# EAGLE design internet_enabled_rov (EAGLE 6.1)
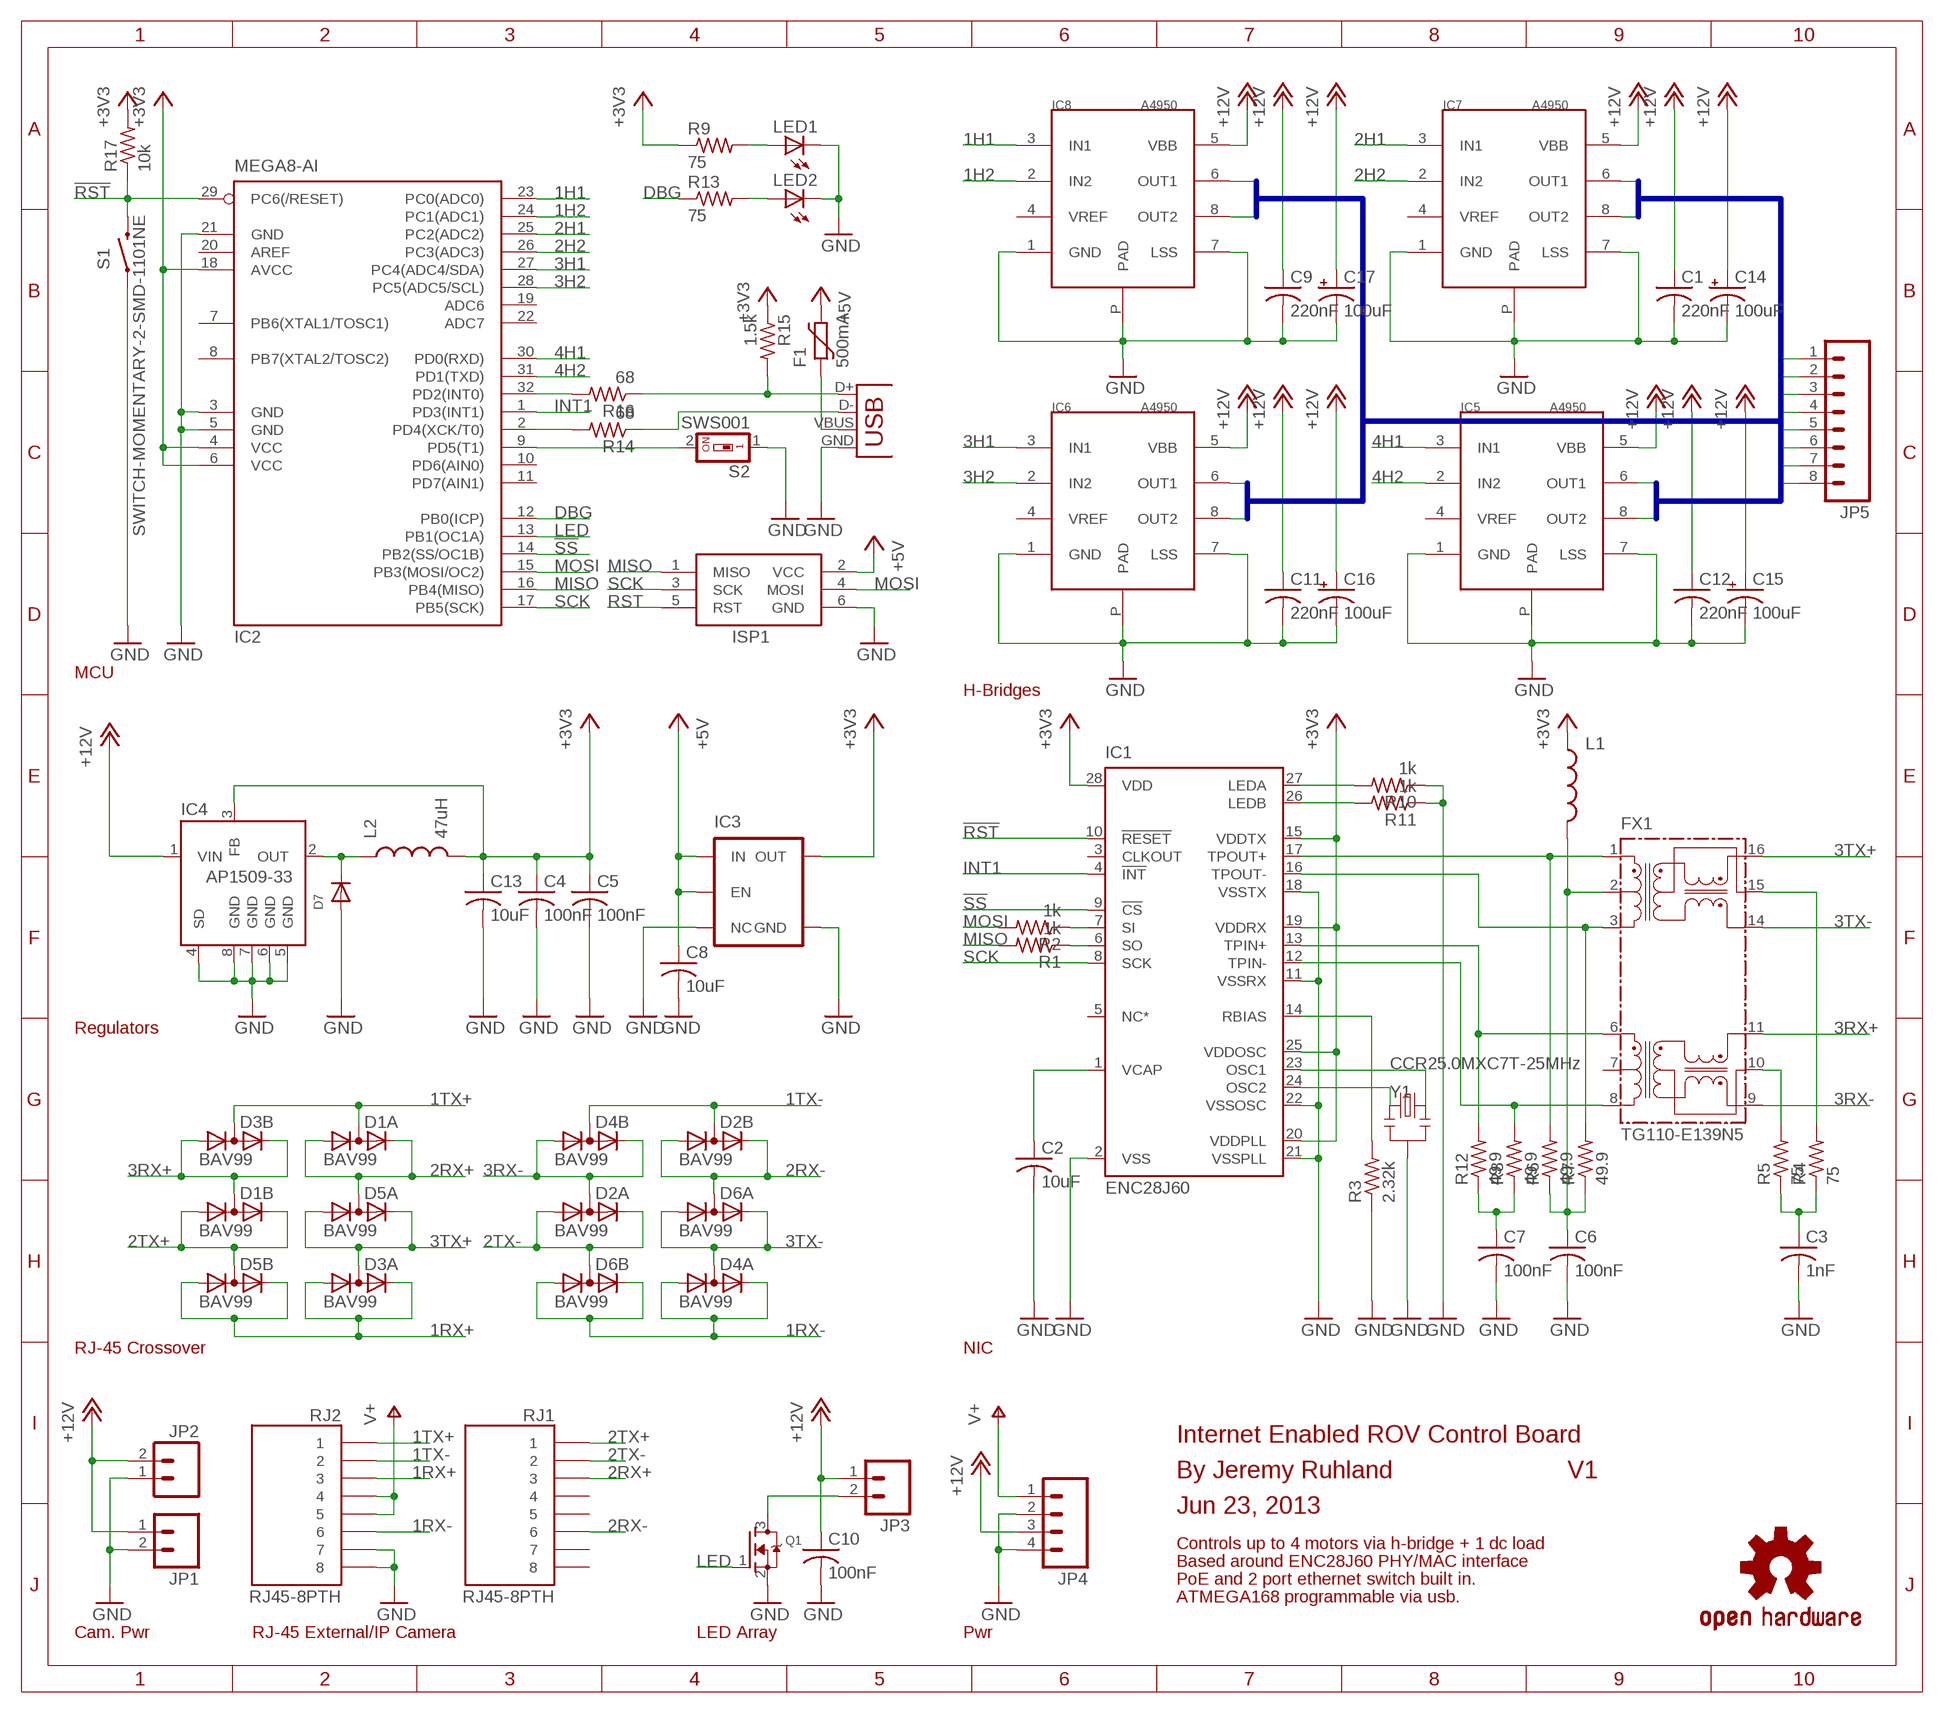
[diagram p0: schematic, sheet 1]

## Parts
C1  220nF  C-USC1206  [C1206]
C2  10uF  C-USC1206  [C1206]
C3  1nF  C-USC1206  [C1206]
C4  100nF  C-USC1206  [C1206]
C5  100nF  C-USC1206  [C1206]
C6  100nF  C-USC1206  [C1206]
C7  100nF  C-USC1206  [C1206]
C8  10uF  C-USC1206  [C1206]
C9  220nF  C-USC1206  [C1206]
C10  100nF  C-USC1206  [C1206]
C11  220nF  C-USC1206  [C1206]
C12  220nF  C-USC1206  [C1206]
C13  10uF  C-USC1206  [C1206]
C14  100uF  CAP_POLD  [PANASONIC_D]
C15  100uF  CAP_POLD  [PANASONIC_D]
C16  100uF  CAP_POLD  [PANASONIC_D]
C17  100uF  CAP_POLD  [PANASONIC_D]
D1  BAV99  [SOT363]
D2  BAV99  [SOT363]
D3  BAV99  [SOT363]
D4  BAV99  [SOT363]
D5  BAV99  [SOT363]
D6  BAV99  [SOT363]
D7  DIODESOD-123  [SOD-123]
F1  500mA  FUSE_PTC-0805  [PTC0805]
FX1  TG110-E139N5  [N5]
IC1  ENC28J60  [SO28W]
IC2  MEGA8-AI  [TQFP32-08]
IC3  V_REG_TPS76433SOT23-5  [SOT23-5]
IC4  AP1509-33  AP1509  [SOP-8]
IC5  A4950  [SOIC-8-PAD]
IC6  A4950  [SOIC-8-PAD]
IC7  A4950  [SOIC-8-PAD]
IC8  A4950  [SOIC-8-PAD]
ISP1  AVRISP-6  [AVRISP]
JP1  M02LOCK  [1X02_LOCK]
JP2  M02LOCK  [1X02_LOCK]
JP3  M02LOCK  [1X02_LOCK]
JP4  M04SCREW_LOCK  [SCREWTERMINAL-3.5MM-4_LOCK]
JP5  M083.5MM-8  [SCREWTERMINAL-3.5MM-8]
L1  INDUCTOR1210  [1210]
L2  47uH  INDUCTOR1210  [1210]
LED1  LEDCHIPLED_1206  [CHIPLED_1206]
LED2  LEDCHIPLED_1206  [CHIPLED_1206]
Q1  MOSFET-NREFLOW  [SOT23]
R1  1k  R-US_R1206  [R1206]
R2  1k  R-US_R1206  [R1206]
R3  2.32k  R-US_R1206  [R1206]
R4  75  R-US_R1206  [R1206]
R5  75  R-US_R1206  [R1206]
R6  49.9  R-US_R1206  [R1206]
R7  49.9  R-US_R1206  [R1206]
R8  49.9  R-US_R1206  [R1206]
R9  75  R-US_R1206  [R1206]
R10  1k  R-US_R1206  [R1206]
R11  1k  R-US_R1206  [R1206]
R12  49.9  R-US_R1206  [R1206]
R13  75  R-US_R1206  [R1206]
R14  68  R-US_R1206  [R1206]
R15  1.5k  R-US_R1206  [R1206]
R16  68  R-US_R1206  [R1206]
R17  10k  R-US_R1206  [R1206]
RJ1  RJ45-8PTH  [RJ45-8]
RJ2  RJ45-8PTH  [RJ45-8]
S1  SWITCH-MOMENTARY-2-SMD-1101NE  [TACTILE-SWITCH-1101NE]
S2  SWS001  [SMS-001]
U$1  OSHW-LOGOL  [OSHW-LOGO-L]
X1  USBSMD  [USB-MINIB]
Y1  CCR25.0MXC7T-25MHz  RESONATORSMD  [RESONATOR-SMD]

## Nets
1H1: IC2.23(PC0(ADC0)) IC8.3(IN1)
1H2: IC2.24(PC1(ADC1)) IC8.2(IN2)
1RX+: D3.1(A:A) D3.2(A:K) D5.4(B:A) D5.5(B:K) RJ2.3
1RX-: D4.1(A:A) D4.2(A:K) D6.4(B:A) D6.5(B:K) RJ2.6
1TX+: D1.6(A:AK) D3.3(B:AK) RJ2.1
1TX-: D2.3(B:AK) D4.3(B:AK) RJ2.2
2H1: IC2.25(PC2(ADC2)) IC7.3(IN1)
2H2: IC2.26(PC3(ADC3)) IC7.2(IN2)
2RX+: D1.1(A:A) D1.2(A:K) D5.6(A:AK) RJ1.3
2RX-: D2.4(B:A) D2.5(B:K) D6.6(A:AK) RJ1.6
2TX+: D1.4(B:A) D1.5(B:K) D5.3(B:AK) RJ1.1
2TX-: D2.1(A:A) D2.2(A:K) D6.3(B:AK) RJ1.2
3H1: IC2.27(PC4(ADC4/SDA)) IC6.3(IN1)
3H2: IC2.28(PC5(ADC5/SCL)) IC6.2(IN2)
3RX+: D1.3(B:AK) D3.4(B:A) D3.5(B:K) FX1.11
3RX-: D2.6(A:AK) D4.4(B:A) D4.5(B:K) FX1.9
3TX+: D3.6(A:AK) D5.1(A:A) D5.2(A:K) FX1.16
3TX-: D4.6(A:AK) D6.1(A:A) D6.2(A:K) FX1.14
4H1: IC2.30(PD0(RXD)) IC5.3(IN1)
4H2: IC2.31(PD1(TXD)) IC5.2(IN2)
!RST: IC1.10(!RESET) IC2.29(PC6(/RESET)) R17.1 S1.P$2
!SS: IC1.9(!CS) IC2.14(PB2(SS/OC1B))
+3V3: C4.1 C5.1 C13.1 IC1.15(VDDTX) IC1.19(VDDRX) IC1.20(VDDPLL) IC1.25(VDDOSC) IC1.28(VDD) IC2.4(VCC) IC2.6(VCC) IC2.18(AVCC) IC3.5(OUT) IC4.3(FB) L1.1 L2.2 R9.1 R15.1 R17.2
+5V: C8.1 F1.2 IC3.1(IN) IC3.3(EN) ISP1.2(VCC)
+12V: C1.1 C9.1 C10.1 C11.1 C12.1 C14.+ C15.+ C16.+ C17.+ IC4.1(VIN) IC5.5(VBB) IC6.5(VBB) IC7.5(VBB) IC8.5(VBB) JP1.1 JP2.2 JP3.1 JP4.3
DBG: IC2.12(PB0(ICP)) R13.1
GND: C1.2 C2.2 C3.2 C4.2 C5.2 C6.2 C7.2 C8.2 C9.2 C10.2 C11.2 C12.2 C13.2 C14.- C15.- C16.- C17.- D7.A IC1.2(VSS) IC1.11(VSSRX) IC1.18(VSSTX) IC1.21(VSSPLL) IC1.22(VSSOSC) IC2.3(GND) IC2.5(GND) IC2.21(GND) IC3.2(GND) IC3.4(NC) IC4.4(SD) IC4.5(GND) IC4.6(GND) IC4.7(GND) IC4.8(GND) IC5.1(GND) IC5.7(LSS) IC5.P(PAD) IC6.1(GND) IC6.7(LSS) IC6.P(PAD) IC7.1(GND) IC7.7(LSS) IC7.P(PAD) IC8.1(GND) IC8.7(LSS) IC8.P(PAD) ISP1.6(GND) JP1.2 JP2.1 JP4.2 JP4.4 LED1.C LED2.C Q1.2(S) R3.1 R10.1 R11.1 RJ2.7 RJ2.8 S1.P$1 S2.1 X1.GND Y1.2
INT1: IC1.4(!INT) IC2.1(PD3(INT1))
LED: IC2.13(PB1(OC1A)) Q1.1(G)
MISO: IC2.16(PB4(MISO)) ISP1.1(MISO) R1.2
MOSI: IC2.15(PB3(MOSI/OC2)) ISP1.4(MOSI) R2.2
N$1: IC1.6(SO) R1.1
N$2: F1.1 X1.VBUS
N$3: LED1.A R9.2
N$4: LED2.A R13.2
N$5: IC1.7(SI) R2.1
N$7: D7.C IC4.2(OUT) L2.1
N$17: FX1.10 R5.2
N$18: FX1.15 R4.2
N$19: IC2.32(PD2(INT0)) R16.2
N$20: IC2.2(PD4(XCK/T0)) R14.2
N$21: IC2.9(PD5(T1)) S2.2
N$22: JP3.2 Q1.3(D)
N$23: C3.1 R4.1 R5.1
N$24: C7.1 R8.1 R12.1
N$25: C6.1 FX1.2 L1.2 R6.1 R7.1
N$26: FX1.3 IC1.16(TPOUT-) R7.2
N$27: FX1.1 IC1.17(TPOUT+) R6.2
N$28: FX1.8 IC1.12(TPIN-) R8.2
N$29: FX1.6 IC1.13(TPIN+) R12.2
N$32: R15.2 R16.1 X1.D+
N$33: R14.1 X1.D-
N$34: C2.1 IC1.1(VCAP)
N$35: IC1.14(RBIAS) R3.2
N$36: IC1.24(OSC2) Y1.1
N$37: IC1.23(OSC1) Y1.3
N$38: IC1.27(LEDA) R10.2
N$39: IC1.26(LEDB) R11.2
OUT1: IC8.8(OUT2) JP5.2
OUT2: IC8.6(OUT1) JP5.1
OUT3: IC7.8(OUT2) JP5.4
OUT4: IC7.6(OUT1) JP5.3
OUT5: IC6.8(OUT2) JP5.6
OUT6: IC6.6(OUT1) JP5.5
OUT7: IC5.8(OUT2) JP5.8
OUT8: IC5.6(OUT1) JP5.7
RST: ISP1.5(RST)
SCK: IC1.8(SCK) IC2.17(PB5(SCK)) ISP1.3(SCK)
V+: JP4.1 RJ2.4 RJ2.5
Unconnected: FX1.7 IC1.3(CLKOUT) IC1.5(NC*) IC2.7(PB6(XTAL1/TOSC1)) IC2.8(PB7(XTAL2/TOSC2)) IC2.10(PD6(AIN0)) IC2.11(PD7(AIN1)) IC2.19(ADC6) IC2.20(AREF) IC2.22(ADC7) IC5.4(VREF) IC6.4(VREF) IC7.4(VREF) IC8.4(VREF) RJ1.4 RJ1.5 RJ1.7 RJ1.8

## Buses
OUT[1..8]

## Notes on the sheet
- MCU
- H-Bridges
- Regulators
- RJ-45 Crossover | NIC
- Internet Enabled ROV Control Board
- By Jeremy Ruhland | V1
- Jun 23, 2013
- Controls up to 4 motors via h-bridge + 1 dc load
- Based around ENC28J60 PHY/MAC interface
- PoE and 2 port ethernet switch built in.
- ATMEGA168 programmable via usb.
- Cam. Pwr | RJ-45 External/IP Camera | LED Array | Pwr

## Library data of the parts
C1-C13 = adafruit:C-US: CAPACITOR, American symbol
C14-C17 = sparkfun:CAP_POL: Capacitor Polarized These are standard SMD and PTH capacitors. Normally 10uF, 47uF, and 100uF in electrolytic and tantalum varieties. Always verify the external diameter of the through hole cap, it varies with capacity, voltage, and manufacturer. The EIA devices should be standard.
D1-D6 = nxp:BAV99
D7 = adafruit:DIODE: Diode SMADIODE - SMA Surface Mount Package 20V 1A Schottky Diode Digikey: 641-1014-6-ND DO-1N4148 - Through Hole Small Current Diode SOD-123 20V 1 A (.5mV Vf) Schottky Diode - Digikey: MBRX120TPMSCT-ND SOD-323 10V 570mA (.38mV Vf, 3ns) Schottky Diode - Digikey: ZLLS410CT-ND SOD-523 30V 30mA Schottky Diode (RB751S-40TE61) - Digikey: RB751S-40TE61CT-ND SOT23-R/W - SOT23 Package (R = Solder Paste/Reflow Ovens, W = Hand-Soldering) BAT54Film 40V 300mA - Digikey: 497-7162-1-ND
F1 = dp_devices:FUSE_PTC: Resettable PTC
FX1 = halo-electronics:TG110-E*N5: E-Ultra (TM) 10/100BASE-TX SOIC-16 Fast Ethernet Magnetic Modules Source: www.haloelectronics.com .. e-ultra.pdf
IC1 = microchip:ENC28J60: Stand-Alone Ethernet Controller with SPI Interface Source: http://ww1.microchip.com/downloads/en/DeviceDoc/39662c.pdf
IC2 = atmel:MEGA8: MICROCONTROLLER 8 Kbytes FLASH, 1 kbytes SRAM, 512 bytes EEPROM, USART, 6-channel 10 bit ADC, 2-channel 8 bit ADC Pin compatible with Atmega48, ATMega88, ATMega168 Source: avr.lbr; MPN: ATMEGA8-16AU; OC_FARNELL: 9171371; OC_NEWARK: 73M8863
IC3 = sparkfun:V_REG_TPS76433: Voltage Regulator Older TI part. LDO 150mA regulator. No output by-pass cap option. See V_REG_LDO for a better part.
IC4 = diodes-inc:AP1509: 150KHz, 2A PWM BUCK DC/DC CONVERTER
IC5-IC8 = allegro:A4950
ISP1 = adafruit:AVRISP: AVR ISP HEADER Standard 6 pin header for AVR programming
JP1-JP3 = sparkfun:M02: Header 2 Standard 2-pin 0.1" header. Use with straight break away headers (SKU : PRT-00116), right angle break away headers (PRT-00553), swiss pins (PRT-00743), machine pins (PRT-00117), and female headers (PRT-00115). Molex polarized connector foot print use with SKU : PRT-08233 with associated crimp pins and housings.
JP4 = sparkfun:M04: Header 4 Standard 4-pin 0.1" header. Use with straight break away headers (SKU : PRT-00116), right angle break away headers (PRT-00553), swiss pins (PRT-00743), machine pins (PRT-00117), and female headers (PRT-00115). Molex polarized connector foot print use with SKU : PRT-08231 with associated crimp pins and housings. 1MM SMD Version SKU: PRT-10208
JP5 = sparkfun:M08: Header 8 Standard 8-pin 0.1" header. Use with straight break away headers (SKU : PRT-00116), right angle break away headers (PRT-00553), swiss pins (PRT-00743), machine pins (PRT-00117), and female headers (PRT-00115).
L1 L2 = sparkfun:INDUCTOR: Inductors Basic Inductor/Choke - 0603 and 1206. Footprints are not proven and vary greatly between part numbers.
LED1 LED2 = adafruit:LED: LED OSRAM: - CHIPLED LG R971, LG N971, LY N971, LG Q971, LY Q971, LO R971, LY R971 LH N974, LH R974 LS Q976, LO Q976, LY Q976 LO Q996 - Hyper CHIPLED LW Q18S LB Q993, LB Q99A, LB R99A - SideLED LS A670, LO A670, LY A670, LG A670, LP A670 LB A673, LV A673, LT A673, LW A673 LH A674 LY A675 LS A676, LA A676, LO A676, LY A676, LW A676 LS A679, LY A679, LG A679 - Hyper Micro SIDELED® LS Y876, LA Y876, LO Y876, LY Y876 LT Y87S - SmartLED LW L88C, LW L88S LB L89C, LB L89S, LG L890 LS L89K, LO L89K, LY L89K LS L896, LA L896, LO L896, LY L896 - TOPLED LS T670, LO T670, LY T670, LG T670, LP T670 LSG T670, LSP T670, LSY T670, LOP T670, LYG T670 LG T671, LOG T671, LSG T671 LB T673, LV T673, LT T673, LW T673 LH T674 LS T676, LA T676, LO T676, LY T676, LB T676, LH T676, LSB T676, LW T676 LB T67C, LV T67C, LT T67C, LS T67K, LO T67K, LY T67K, LW E67C LS E67B, LA E67B, LO E67B, LY E67B, LB E67C, LV E67C, LT E67C LW T67C LS T679, LY T679, LG T679 LS T770, LO T770, LY T770, LG T770, LP T770 LB T773, LV T773, LT T773, LW T773 LH T774 LS E675, LA E675, LY E675, LS T675 LS T776, LA T776, LO T776, LY T776, LB T776 LHGB T686 LT T68C, LB T68C - Hyper Mini TOPLED® LB M676 - Mini TOPLED Santana® LG M470 LS M47K, LO M47K, LY M47K Source: http://www.osram.convergy.de/
Q1 = adafruit:MOSFET-N: N-Channel Mosfet 2N7002E - 60V 260mA SOT23 [Digikey: 2N7002ET1GOSTR-ND] - REEL BSH103 - 30V 850mA SOT23 [Digikey: 568-5013-1-ND]
R1-R17 = resistor:R-US_: RESISTOR, American symbol
RJ1 RJ2 = sparkfun:RJ45-8: RJ45 Jack Simple RJ45, 8-pin connection - connector for common Cat5, Cat5e, and Cat6 Ethernet cables. Footprint not yet proven in production. Connector sku is PRT-00643; Breakout PCB sku is BOB-00716.
S1 = sparkfun:SWITCH-MOMENTARY-2
S2 = smd-special:SWS001: SMD Dip Switch 1 pol.
U$1 = sparkfun:OSHW-LOGO: Open Source Hardware Logo This logo indicates the piece of hardware it is found on incorporates a OSHW license and/or adheres to the definition of open source hardware found here: http://freedomdefined.org/OSHW
X1 = sparkfun:USB: USB Connectors USB-B-PTH is fully proven SKU : PRT-00139 USB-miniB is fully proven SKU : PRT-00587 USB-A-PCB is untested. USB-A-H is throughly reviewed, but untested. Spark Fun Electronics SKU : PRT-00437 USB-B-SMT is throughly reviewed, but untested. Needs silkscreen touching up. USB-A-S has not been used/tested USB-MB-H has not been used/tested
Y1 = sparkfun:RESONATOR: Resonator Small SMD resonator. This is the itty bitty 10/20MHz resonators with built in caps. CSTCE10M0G55 and CSTCE20M0V53. Footprint has been reviewed closely but hasn't been tested yet.

## Board
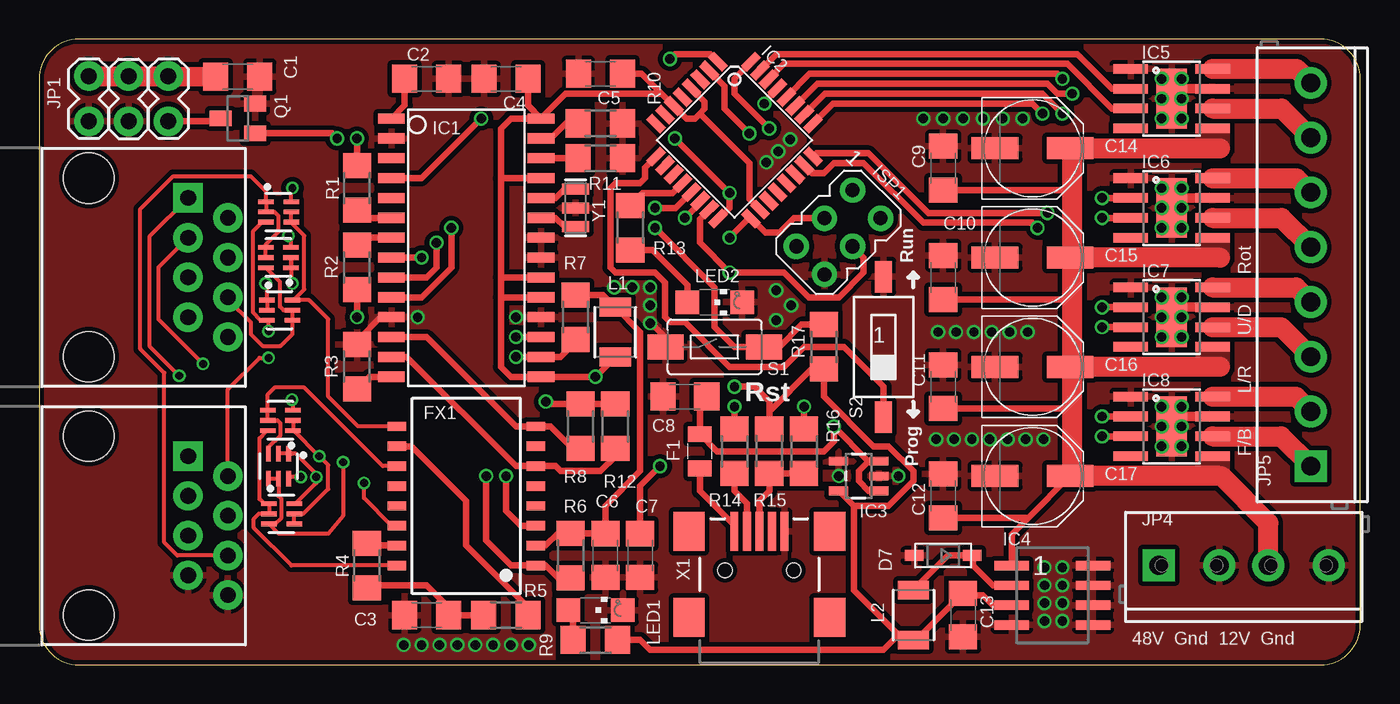
[diagram p1: board, top side]
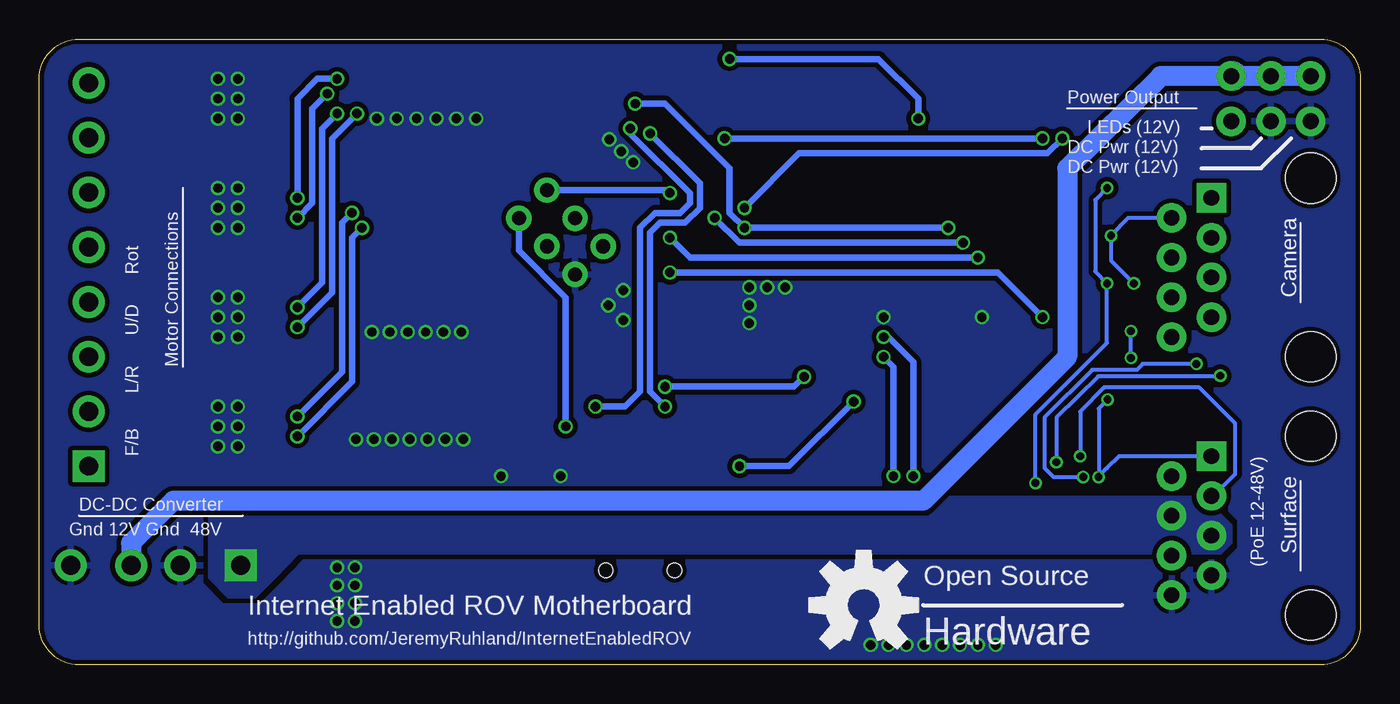
[diagram p2: board, bottom side, seen from below]

Size 84.45 x 40.01 mm. Coordinates in mm from the lower left corner, seen from the top.
Outline: 0,37.47 0,2.54 arc90 2.54,0 81.92,0 arc90 84.45,2.54 84.45,37.47 arc90 81.92,40.01 2.54,40.01 arc90 0,37.47
Copper layers (1*16): Top 0.035mm / dielectric 1.5mm / Bottom 0.035mm
Design rules: minimum track width 6mil, minimum drill 12mil, track to track 6mil, track to pad 6mil, pad to pad 6mil, via to via 6mil, smd to smd 0mil, copper to edge 10mil, drill to drill 10mil, minimum pad ring 10mil, minimum via ring 6mil, stop-mask expansion 2mil, vias tented up to drill 100mil, thermal gap 10mil

### Footprints (pad centres in the part's own frame; a part is rotated, then mirrored left to right if it is on the bottom)
C1206 = smd 1.6 x 1.8: 1 -1.4,0; 2 1.4,0
PANASONIC_D = smd 3 x 1.4: + 2.4,0; - -2.4,0
SOT363 = smd 0.3 x 0.99: 1 -0.65,-0.8; 2 0,-0.8; 3 0.65,-0.8; 4 0.65,0.81; 5 0,0.81; 6 -0.65,0.81
SOD-123 = smd 1.2 x 0.7: A 1.85,0; C -1.85,0
PTC0805 = smd 1 x 1.5: 1 -1.1,0; 2 1.1,0
N5 = smd 0.6 x 1.2: 1 -4.445,-4.445; 2 -3.175,-4.445; 3 -1.905,-4.445; 4 -0.635,-4.445; 5 0.635,-4.445; 6 1.905,-4.445; 7 3.175,-4.445; 8 4.445,-4.445; 9 4.445,4.445; 10 3.175,4.445; 11 1.905,4.445; 12 0.635,4.445; 13 -0.635,4.445; 14 -1.905,4.445; 15 -3.175,4.445; 16 -4.445,4.445
SO28W = smd 0.65 x 1.7: 1 -7.62,-4.78; 2 -6.35,-4.78; 3 -5.08,-4.78; 4 -3.81,-4.78; 5 -2.54,-4.78; 6 -1.27,-4.78; 7 0,-4.78; 8 1.27,-4.78; 9 2.54,-4.78; 10 3.81,-4.78; 11 5.08,-4.78; 12 6.35,-4.78; 13 7.62,-4.78; 14 8.89,-4.78; 15 8.89,4.78; 16 7.62,4.78; 17 6.35,4.78; 18 5.08,4.78; 19 3.81,4.78; 20 2.54,4.78; 21 1.27,4.78; 22 0,4.78; 23 -1.27,4.78; 24 -2.54,4.78; 25 -3.81,4.78; 26 -5.08,4.78; 27 -6.35,4.78; 28 -7.62,4.78
TQFP32-08 = smd 1.27 x 0.559: 1 -4.293,2.8; 2 -4.293,2; 3 -4.293,1.2; 4 -4.293,0.4; 5 -4.293,-0.4; 6 -4.293,-1.2; 7 -4.293,-2; 8 -4.293,-2.8; 17 4.293,-2.8; 18 4.293,-2; 19 4.293,-1.2; 20 4.293,-0.4; 21 4.293,0.4; 22 4.293,1.2; 23 4.293,2; 24 4.293,2.8 | smd 0.559 x 1.27: 9 -2.8,-4.293; 10 -2,-4.293; 11 -1.2,-4.293; 12 -0.4,-4.293; 13 0.4,-4.293; 14 1.2,-4.293; 15 2,-4.293; 16 2.8,-4.293; 25 2.8,4.293; 26 2,4.293; 27 1.2,4.293; 28 0.4,4.293; 29 -0.4,4.293; 30 -1.2,4.293; 31 -2,4.293; 32 -2.8,4.293
SOT23-5 = smd 0.55 x 1.2: 1 -0.95,-1.3; 2 0,-1.3; 3 0.95,-1.3; 4 0.95,1.3; 5 -0.95,1.3
SOP-8 = smd 2.2 x 0.6: 1 -2.6,1.905; 2 -2.6,0.635; 3 -2.6,-0.635; 4 -2.6,-1.905; 5 2.6,-1.905; 6 2.6,-0.635; 7 2.6,0.635; 8 2.6,1.905
SOIC-8-PAD = smd 0.61 x 2.21: 1 -1.905,-2.616; 2 -0.635,-2.616; 3 0.635,-2.616; 4 1.905,-2.616; 5 1.905,2.616; 6 0.635,2.616; 7 -0.635,2.616; 8 -1.905,2.616 | smd 3.81 x 1.93: P 0,0
AVRISP = drill 0.9 pad 1.626: 1 -1.27,2.54; 2 1.27,2.54; 3 -1.27,0; 4 1.27,0; 5 -1.27,-2.54; 6 1.27,-2.54
1X02_LOCK = drill 1.016 pad 1.88: 1 -0.178,0; 2 2.718,0
SCREWTERMINAL-3.5MM-4_LOCK = drill 1.2 pad 2.032 square: 1 -0.178,0 | drill 1.2 pad 2.032: 2 3.678,0; 3 6.822,0; 4 10.678,0
SCREWTERMINAL-3.5MM-8 = drill 1.2 pad 2.032 square: 1 0,0 | drill 1.2 pad 2.032: 2 3.5,0; 3 7,0; 4 10.5,0; 5 14,0; 6 17.5,0; 7 21,0; 8 24.5,0
1210 = smd 1.2 x 2: 1 -1.6,0; 2 1.6,0
CHIPLED_1206 = smd 1.5 x 1.5: A 0,-1.75; C 0,1.75
SOT23 = smd 1 x 1.4: 1 -0.95,-1.1; 2 0.95,-1.1; 3 0,1.1
R1206 = smd 1.6 x 1.803: 1 -1.422,0; 2 1.422,0
RJ45-8 = drill 1 pad 1.88 square: 1 -4.445,6.35 | drill 1 pad 1.88: 2 -3.175,8.89; 3 -1.905,6.35; 4 -0.635,8.89; 5 0.635,6.35; 6 1.905,8.89; 7 3.175,6.35; 8 4.445,8.89 | hole 3.2: -5.715,0; 5.715,0
TACTILE-SWITCH-1101NE = smd 2.3 x 1.6: P$1 -3.15,0; P$2 3.15,0
SMS-001 = smd 1.092 x 2.007: 1 0,-4.496; 2 0,4.496
USB-MINIB = smd 2.5 x 0.5: D+ 2.5,0; D- 2.5,0.8; GND 2.5,-1.6; ID 2.5,-0.8; VBUS 2.5,1.6 | smd 2.5 x 2: MTN1 -3,4.5; MTN2 2.5,4.5; MTN3 -3,-4.5; MTN4 2.5,-4.5 | hole 0.9: 0,2.2; 0,-2.2
RESONATOR-SMD = smd 0.7 x 1.7: 1 -1.2,0; 2 0,0; 3 1.2,0

### Placement (x,y rotation side)
C1  12.7,37.6 0 top
C2  24.77,37.47 0 top
C3  24.77,3.17 180 top
C4  29.84,37.47 180 top
C5  35.88,37.78 180 top
C6  36.2,6.99 270 top
C7  38.42,6.99 270 top
C8  41.27,17.14 180 top
C9  57.78,31.75 90 top
C10  57.78,24.77 90 top
C11  57.78,17.78 90 top
C12  57.78,10.79 90 top
C13  59.05,3.17 270 top
C14  63.5,33.02 0 top
C15  63.5,26.04 0 top
C16  63.5,19.05 0 top
C17  63.5,12.06 0 top
D1  15.3,12.7 180 top
D2  15.37,22.67 270 top
D3  15.43,15.62 90 top
D4  15.3,28.96 270 top
D5  15.49,9.65 270 top
D6  15.3,26.04 90 top
D7  57.78,6.99 180 top
F1  42.23,13.65 90 top
FX1  27.3,10.79 90 top
IC1  27.3,27.3 270 top
IC2  44.45,33.55 315 top
IC3  52.39,12.06 90 top
IC4  64.77,4.45 0 top
IC5  72.39,36.2 270 top
IC6  72.39,29.21 270 top
IC7  72.39,22.23 270 top
IC8  72.39,15.24 270 top
ISP1  51.09,27.65 315 top
JP1  3.17,37.47 270 top
JP2  5.71,34.92 90 top
JP3  8.26,37.47 270 top
JP4  71.75,6.35 0 top
JP5  81.28,12.7 90 top
L1  36.83,21.27 90 top
L2  55.88,3.17 270 top
LED1  35.56,3.49 270 top
LED2  43.18,23.18 270 top
Q1  12.7,34.92 90 top
R1  20.32,30.48 90 top
R2  20.32,25.4 270 top
R3  20.32,19.05 270 top
R4  20.95,6.35 90 top
R5  29.84,3.17 0 top
R6  33.97,6.99 270 top
R7  34.29,22.23 270 top
R8  34.61,15.24 270 top
R9  35.56,1.59 180 top
R10  35.88,34.61 180 top
R11  35.88,32.38 180 top
R12  36.83,15.24 270 top
R13  37.78,27.94 270 top
R14  44.45,13.65 90 top
R15  46.67,13.65 270 top
R16  48.9,13.65 90 top
R17  50.16,20.32 270 top
RJ1  3.17,25.4 270 top
RJ2  3.17,8.89 270 top
S1  43.18,20.32 0 top
S2  53.98,20.32 180 top
U$1  31.75,3.81 0 bottom
X1  46.04,6.03 90 top
Y1  34.29,29.21 270 top

### Tracks (layer width: path | path; a pad name or v marks a point on that pad's centre or on a via)
1H1  (via drill 0.6)
  Top 0.406: IC8.3 v67.94,14.61 | IC2.23 49.39,31.43 50.16,31.43 50.8,32.07 52.7,32.07 56.52,28.26 63.5,28.26 v63.82,27.94
  Bottom 0.406: v67.94,14.61 64.45,18.1 64.45,27.3 v63.82,27.94
1H2  (via drill 0.6)
  Top 0.406: IC8.2 v67.94,15.88 | v64.45,28.89 56.83,28.89 53.02,32.7 49.68,32.7 IC2.24
  Bottom 0.406: v67.94,15.88 65.09,18.73 65.09,28.26 v64.45,28.89
1RX+  (via drill 0.5)
  Top 0.254: D5.4 D5.5 16.89,9.65 18.48,11.24 18.48,12.76 v17.91,13.34 16.27,14.97 D3.1 D3.2
  Bottom 0.254: RJ2.3 9.4,10.79 8,12.19 8,15.43 10.29,17.72 16.38,17.72 17.91,16.19 v17.91,13.34
1RX-
  Top 0.254: D6.5 D6.4 14.49,26.88 15.3,27.69 15.3,28.7 15.05,28.96 D4.2 D4.1 14.5,30.26 14.48,30.29 | RJ2.6 8.83,6.99 8,7.81 8,18.67 6.48,20.19 6.48,29.15 8.57,31.24 13.53,31.24 14.48,30.29 | 14.48,30.29 14.48,29.72
1TX+  (via drill 0.5)
  Top 0.254: D3.3 16.23,16.89 v16.16,16.95 | v16.73,12 16.07,12 D1.6
  Bottom 0.254: RJ2.1 15.43,13.34 16.19,12.57 16.73,12.06 v16.73,12 16.73,16.38 v16.16,16.95
1TX-  (via drill 0.5)
  Top 0.254: D4.3 14.27,28.31 13.65,27.69 13.65,22.54 14.18,22.02 D2.3 14.67,21.92 v14.67,21.34 | RJ2.2 12.06,17.59 14.1,19.62 v14.67,19.62
  Bottom 0.254: v14.67,19.62 v14.67,21.34
2H1  (via drill 0.6)
  Top 0.406: IC7.3 v67.94,21.59 | IC2.25 50.74,35.88 63.5,35.88 v64.14,35.24
  Bottom 0.406: v67.94,21.59 65.72,23.81 65.72,33.66 v64.14,35.24
2H2  (via drill 0.6)
  Top 0.406: IC7.2 v67.94,22.86 | IC2.26 50.24,36.51 64.14,36.51 v65.41,35.24
  Bottom 0.406: v67.94,22.86 66.36,24.45 66.36,34.29 v65.41,35.24
2RX+  (via drill 0.5)
  Top 0.254: D1.1 D1.2 | D5.6 16.4,10.3 17.72,11.62 v17.72,12 17.72,12.19 16.41,13.5 D1.1 | D1.1 16.22,13.5 | RJ1.3 7.62,25.4 7.62,22.1 v10.48,19.24
  Bottom 0.254: v10.48,19.24 13.91,19.24 14.29,18.86 17.14,18.86 20.19,15.81 20.19,12.57 19.62,12 v17.72,12
2RX-
  Top 0.254: D6.6 15.4,24.48 15.4,22.89 15.62,22.67 D2.5 D2.4 16.18,22.08 16.19,22.1 16.19,21.14 15.43,20.38 14.29,20.38 13.53,21.14 13.53,21.91 12.06,23.37 RJ1.6
2TX+  (via drill 0.5)
  Top 0.254: D1.4 D1.5 15.3,10.79 15.49,10.6 15.49,9.4 15.1,9 D5.3 15.31,8.38 18.48,8.38 19.43,9.53 v19.43,12.95 | RJ1.1 7.05,27.37 7.05,20.38 v8.95,18.48
  Bottom 0.254: v8.95,18.48 8.98,18.45 16.76,18.45 19.43,15.81 v19.43,12.95
2TX-  (via drill 0.5)
  Top 0.254: D2.2 D2.1 14.57,24.3 v14.48,24.38 | D6.3 16.1,27.27 v15.94,27.43
  Bottom 0.254: v14.48,24.38 15.94,25.84 v15.94,27.43 14.86,28.57 RJ1.2
3H1  (via drill 0.6)
  Top 0.406: IC6.3 v67.94,28.57 | IC2.27 49.75,37.15 64.45,37.15 65.09,36.51 v66.04,36.51
  Bottom 0.406: v67.94,28.57 66.99,29.53 66.99,35.56 v66.04,36.51
3H2  (via drill 0.6)
  Top 0.406: IC6.2 v67.94,29.84 | IC2.28 49.25,37.78 65.09,37.78 v65.41,37.47
  Bottom 0.406: v65.41,37.47 66.67,37.47 67.94,36.2 v67.94,29.84
3RX+
  Top 0.254: D1.3 14.65,13.89 15.43,14.67 15.43,15.43 15.24,15.62 D3.5 D3.4 14.62,17.29 15.05,17.72 16.95,17.72 21.97,12.7 FX1.11
3RX-
  Top 0.254: D4.5 D4.4 16.08,28.31 16.95,27.43 16.95,24 16.27,23.32 D2.6 17.26,23.32 18.48,22.1 18.48,17.14 20.38,15.24 FX1.9
3TX+
  Top 0.254: D3.6 14.59,14.97 14.1,14.48 14.1,10.6 14.4,10.3 D5.1 D5.2 14.03,9.65 13.72,9.34 13.72,8.76 16.13,6.35 FX1.16
3TX-  (via drill 0.5)
  Top 0.254: FX1.14 22.54,8.89 20.77,10.67 v20.77,11.62 | D6.1 D6.2 16.1,24.47 v16.19,24.38 | D4.6 16.11,30.4 v16.19,30.48
  Bottom 0.254: v16.19,30.48 16.95,29.72 16.95,25.15 v16.19,24.38 16.19,20.57 20.77,16 v20.77,11.62
4H1
  Top 0.406: IC2.30 47.62,38.42 65.72,38.42 68.58,35.56 IC5.3
4H2
  Top 0.406: IC2.31 47.13,39.05 66.36,39.05 68.58,36.83 IC5.2
!RST  (via drill 0.6)
  Top 0.406: IC1.10 24.45,23.5 26.35,25.4 v26.35,27.94 | IC2.29 46.35,36.02 v46.35,35.88 | R17.1 48.74,21.74 47.32,20.32 S1.P$2 44.45,20.32 43.18,21.59 43.18,24.13 v39.37,27.94
  Bottom 0.406: v26.35,27.94 v39.37,27.94 40.32,28.89 40.32,31.75 44.45,35.88 v46.35,35.88
!SS  (via drill 0.6)
  Top 0.406: IC1.9 24.77,24.77 25.4,25.4 v25.4,26.99 | IC2.14 42.26,29.56 v41.27,28.57
  Bottom 0.406: v25.4,26.99 39.69,26.99 v41.27,28.57
+3V3  (via drill 0.6)
  Top 0.406: IC4.3 60.96,3.81 60.33,4.45 59.19,4.45 C13.1 56.05,1.57 L2.2 55.26,1.57 54.93,1.91 | 32.07,34.92 IC1.28 31.25,35.77 C4.1 31.25,35.75 32.07,34.92 | 32.07,34.92 30.16,34.92 29.53,34.29 29.53,31.11 | 29.53,31.11 29.53,24.77 | 29.53,24.77 29.53,23.5 | 29.53,23.5 29.53,19.05 30.16,18.41 IC1.15 v35.56,18.41 36.83,19.68 L1.1 | IC1.25 29.53,31.11 | IC1.20 29.53,24.77 | IC1.19 29.53,23.5 | IC2.4 42.55,36.02 42.55,35.56 42.23,35.24 | 42.23,35.24 41.91,34.92 41.37,34.92 IC2.6 39.79,36.51 | IC2.18 45.4,29.77 45.4,32.07 42.23,35.24 | 32.07,34.92 33.66,36.51 39.79,36.51 | 39.79,36.51 38.52,37.78 C5.1 | 46.67,16.19 49.38,18.9 R17.2 50.16,17.14 53.34,13.97 54.29,13.97 55.88,12.38 55.88,11.75 54.29,10.16 52.07,10.16 | 46.67,16.19 R15.1 | 46.67,16.19 46.67,16.83 45.72,17.78 v44.45,17.78 | 54.93,1.91 52.07,4.76 52.07,10.16 | R9.1 38.42,1.59 39.05,0.95 53.98,0.95 54.93,1.91 | 52.07,10.16 51.12,11.11 IC3.5
  Bottom 0.406: v44.45,17.78 36.2,17.78 v35.56,18.41
+5V  (via drill 0.6)
  Top 0.406: C8.1 42.23,16.7 F1.2 43.33,13.65 50.16,13.65 50.8,14.29 v50.8,15.24 v50.8,15.23 53.02,13.02 | IC3.1 53.02,11.12 52.39,11.75 52.39,12.38 53.02,13.02 | IC3.3 53.02,13.02
  Bottom 0.406: v50.8,15.24 50.8,23.5 53.79,26.48 ISP1.2
+12V
  Top 0.406: 66.04,19.05 66.04,17.29 | 65.9,25.26 66.04,25.4 | 65.9,32.88 66.04,33.02 | C9.1 65.91,30.35 66.04,30.48 | C10.1 65.53,23.36 66.04,22.86 | C11.1 65.91,16.38 66.04,16.51 | C12.1 63.23,9.39 | 63.23,9.39 C17.+ | IC4.1 62.17,8.34 63.23,9.39
  Top 1.27: 75.47,12.06 66.04,12.06 | 66.04,12.06 C17.+ | 66.04,12.06 66.04,16.51 66.04,19.05 | 66.04,19.05 66.04,22.86 66.04,25.4 66.04,26.04 | 75.47,33.02 66.04,33.02 66.04,30.48 66.04,26.04 | 75.47,26.04 66.04,26.04 | 75.47,19.05 66.04,19.05 | C16.+ 66.04,19.05 | C15.+ 66.04,26.04 | C14.+ 65.9,32.88 | JP4.3 78.58,9.05 75.56,12.06 | JP1.1 JP2.2 JP3.1 C1.1
  Bottom 1.27: JP1.1 8.19,37.64 | JP3.1 12.76,37.64 18.73,31.75 18.73,19.68 27.94,10.48 75.88,10.48 78.58,7.78 JP4.3
  Bottom 1.93: 8.19,37.64 JP3.1
  pour Top (no thermals): 76.1,33.02 76.1,34.29 73.91,34.29 73.91,33.02
  pour Top (no thermals): 76.1,26.04 76.1,27.3 73.91,27.3 73.91,26.04
  pour Top (no thermals): 76.1,19.05 76.1,20.32 73.91,20.32 73.91,19.05
  pour Top (no thermals): 76.1,12.06 76.1,13.34 73.91,13.34 73.91,12.06
DBG
  Top 0.406: IC2.12 40.5,30.16 38.58,30.16 R13.1
GND  (via drill 0.6)
  Top 0.406: v39.05,21.84 39.05,21.91 40.01,20.95 40.01,20.34 S1.P$1 | R3.1 20.32,20.7 21.91,22.29 21.97,22.23 IC1.11
  Top 0.61: IC5.7 73.03,36.83 v73.03,37.47 IC5.P | IC6.7 73.03,29.84 v73.03,30.48 IC6.P | IC7.7 73.03,22.86 v73.03,23.5 IC7.P | IC8.7 72.39,15.88 72.39,16.19
  other vias: 71.75,34.92 71.75,36.2 71.75,37.47 73.03,34.92 73.03,36.2 71.75,27.94 71.75,29.21 71.75,30.48 73.03,27.94 73.03,29.21 71.75,20.95 71.75,22.23 71.75,23.5 73.03,20.95 73.03,22.23 71.75,13.97 71.75,15.24 71.75,16.51 73.03,13.97 73.03,15.24 73.03,16.51 30.48,22.23 61.59,34.92 60.33,34.92 59.05,34.92 57.78,34.92 56.52,34.92 62.87,34.92 54.93,12.06 51.12,12.06 39.05,24.13 39.05,22.99 37.91,24.13 36.77,24.13 47.12,23.94 47.12,22.03 48.07,22.99 46.48,32.13 47.24,32.83 48.01,33.59 64.2,14.41 63.06,14.41 61.91,14.41 60.77,14.41 59.63,14.41 58.48,14.41 57.34,14.41 65.41,6.22 64.26,6.22 64.26,5.08 65.41,5.08 65.41,3.94 64.26,3.94 64.26,2.79 65.41,2.79 31.31,1.27 30.16,1.27 29.02,1.27 27.88,1.27 26.73,1.27 25.59,1.27 24.45,1.27 23.3,1.27 63.18,21.27 62.04,21.27 60.9,21.27 59.75,21.27 58.61,21.27 57.47,21.27 24.19,22.23
  pour Top (isolate 0.305, rank 2): 0,40.01 0,0 84.45,0 84.45,40.01
  pour Bottom (isolate 0.305, rank 2): 0,40.01 0,0 84.45,0 84.45,40.01
INT1  (via drill 0.6)
  Top 0.406: IC1.4 24.45,31.11 v28.26,34.92 | IC2.1 42.9,39.05 40.64,39.05 v40.32,38.73
  Bottom 0.406: v28.26,34.92 28.26,36.2 30.8,38.73 v40.32,38.73
LED  (via drill 0.6)
  Top 0.406: Q1.1 18.73,33.98 v19.05,33.66 | IC2.13 40.68,29.21 v39.37,29.21
  Bottom 0.406: v19.05,33.66 20,32.7 35.88,32.7 v39.37,29.21
MISO  (via drill 0.6)
  Top 0.406: R1.2 v20.32,33.66 | IC2.16 43.45,28.53 44.13,29.21 v44.13,30.16 v40.64,33.66
  Bottom 0.406: v20.32,33.66 v40.64,33.66 | v44.13,30.16 44.32,30.35 ISP1.1
MOSI  (via drill 0.6)
  Top 0.406: R2.2 v20.32,22.23 | IC2.15 42.23,28.5 42.23,26.99 v44.13,25.08 47.62,25.08 49.21,23.5 51.12,23.5 52.7,25.08 52.7,26.04 ISP1.4
  Bottom 0.406: v44.13,25.08 23.18,25.08 v20.32,22.23
N$1
  Top 0.406: IC1.6 20.8,28.57 R1.1
N$2
  Top 0.406: X1.VBUS 44.44,8.9 42.23,11.11 F1.1
N$3
  Top 0.406: R9.2 34.14,3.33 33.97,3.49 LED1.A
N$4
  Top 0.406: R13.2 39.2,26.52 41.43,24.29 LED2.A
N$5
  Top 0.406: IC1.7 20.8,27.3 R2.1
N$7
  Top 0.406: IC4.2 60.96,5.08 59.69,6.35 59.69,6.93 D7.C 58.09,6.99 L2.1
N$17
  Top 0.406: R5.2 31.27,3.66 27.3,7.62 27.3,10.48 23.81,13.97 FX1.10
N$18
  Top 0.406: FX1.15 20.95,7.62 R4.2
N$19  (via drill 0.6)
  Top 0.406: IC2.32 45.51,38.52 44.45,37.47 44.45,36.51 v46.67,34.29 | R16.2 v48.9,16.51
  Bottom 0.406: v48.9,16.51 46.99,16.51 46.04,17.46 46.04,27.94 45.09,28.89 43.5,28.89 42.86,29.53 42.86,30.16 46.67,33.97 v46.67,34.29
N$20  (via drill 0.6)
  Top 0.406: IC2.2 43.81,37.01 43.81,35.56 v45.4,33.97 | R14.2 v44.45,16.51
  Bottom 0.406: v44.45,16.51 45.4,17.46 45.4,27.62 44.77,28.26 43.18,28.26 42.23,29.21 42.23,30.8 v45.4,33.97
N$21
  Top 0.406: IC2.9 38.73,31.79 38.73,31.11 38.42,30.8 36.83,30.8 36.51,30.48 36.51,25.4 36.83,25.08 39.37,25.08 40.01,24.45 40.01,22.23 40.32,21.91 41.27,21.91 44.13,19.05 47.62,19.05 48.9,20.32 51.44,20.32 53.98,17.78 S2.2
N$22
  Top 0.406: JP3.2 11.25,34.75 11.43,34.92 Q1.3
N$23
  Top 0.406: R5.1 C3.1 26.16,3.68 24.77,5.08 21.11,5.08 R4.1
N$24  (via drill 0.6)
  Top 0.406: R12.1 R8.1 32.55,16.66 v32.38,16.83 | C7.1 38.42,11.43 v39.69,12.7
  Bottom 0.406: v39.69,12.7 36.51,12.7 v32.38,16.83
N$25
  Top 0.406: FX1.2 32.38,7.62 33.17,8.41 R6.1 36.03,8.41 36.2,8.57 C6.1 36.2,10.16 38.42,12.38 38.42,21.29 L1.2 36.06,23.65 R7.1
N$26  (via drill 0.6)
  Top 0.406: R7.2 34.29,20.64 33.34,19.68 IC1.16 v30.48,19.68 | FX1.3 30.8,8.89 29.84,9.84 v29.84,12.06
  Bottom 0.406: v29.84,12.06 29.84,19.05 v30.48,19.68
N$27  (via drill 0.6)
  Top 0.406: R6.2 33.17,5.56 32.38,6.35 FX1.1 30.16,6.35 28.57,7.94 v28.57,12.06 | IC1.17 v30.48,20.95
  Bottom 0.406: v30.48,20.95 30.16,20.95 28.57,19.37 v28.57,12.06
N$28
  Top 0.406: IC1.12 24.77,20.95 30.48,15.24 FX1.8 32.7,15.24 33.97,13.97 34.46,13.97 R8.2
N$29
  Top 0.406: IC1.13 23.5,19.68 30.48,12.7 FX1.6 33.02,12.7 33.34,12.38 35.88,12.38 36.83,13.34 R12.2
N$32
  Top 0.406: X1.D+ 46.04,10.48 46.67,11.11 R15.2 R16.1
N$33
  Top 0.406: X1.D- 45.24,10.32 44.45,11.11 R14.1
N$34
  Top 0.406: IC1.1 23.36,35.77 C2.1
N$35
  Top 0.406: IC1.14 21.11,18.41 R3.2
N$36
  Top 0.406: IC1.24 33.02,29.84 33.59,30.41 Y1.1
N$37
  Top 0.406: IC1.23 33.02,28.57 33.59,28.01 Y1.3
N$38
  Top 0.406: IC1.27 32.7,33.66 33.66,34.61 R10.2
N$39
  Top 0.406: IC1.26 R11.2
OUT1
  Top 1.27: IC8.8 80.33,17.14 JP5.2
OUT2
  Top 1.27: IC8.6 79.38,14.61 JP5.1
OUT3
  Top 1.27: IC7.8 80.35,24.13 JP5.4
OUT4
  Top 1.27: IC7.6 79.39,21.59 JP5.3
OUT5
  Top 1.27: IC6.8 80.36,31.11 JP5.6
OUT6
  Top 1.27: IC6.6 79.41,28.57 JP5.5
OUT7
  Top 1.27: IC5.8 80.38,38.1 JP5.8
OUT8
  Top 1.27: IC5.6 79.42,35.56 JP5.7
SCK  (via drill 0.6)
  Top 0.406: IC1.8 v24.45,26.04 | v44.13,27.3 45.36,28.53 IC2.17 46.41,27.62 47.31,27.62 48.24,28.55 ISP1.3
  Bottom 0.406: v24.45,26.04 42.86,26.04 v44.13,27.3
V+
  pour Bottom (isolate 0.305, no thermals): 73.66,5.52 73.66,9.53 27.62,9.53 26.35,10.79 10.03,10.79 8.19,8.95 8.19,7.75 8.89,7.05 67.88,7.05 69.34,5.52 70.61,4.25 72.39,4.25

### Text on the board
_tsilk: Run | Rst | Prog | F/B L/R U/D Rot | 48V Gnd 12V Gnd
_bsilk: Power Output | LEDs (12V) | DC Pwr (12V) | DC Pwr (12V) | Camera | Motor Connections | (PoE 12-48V) | F/B L/R U/D Rot | Surface | DC-DC Converter | Gnd 12V Gnd 48V | Open Source | Internet Enabled ROV Motherboard | Hardware | http://github.com/JeremyRuhland/InternetEnabledROV